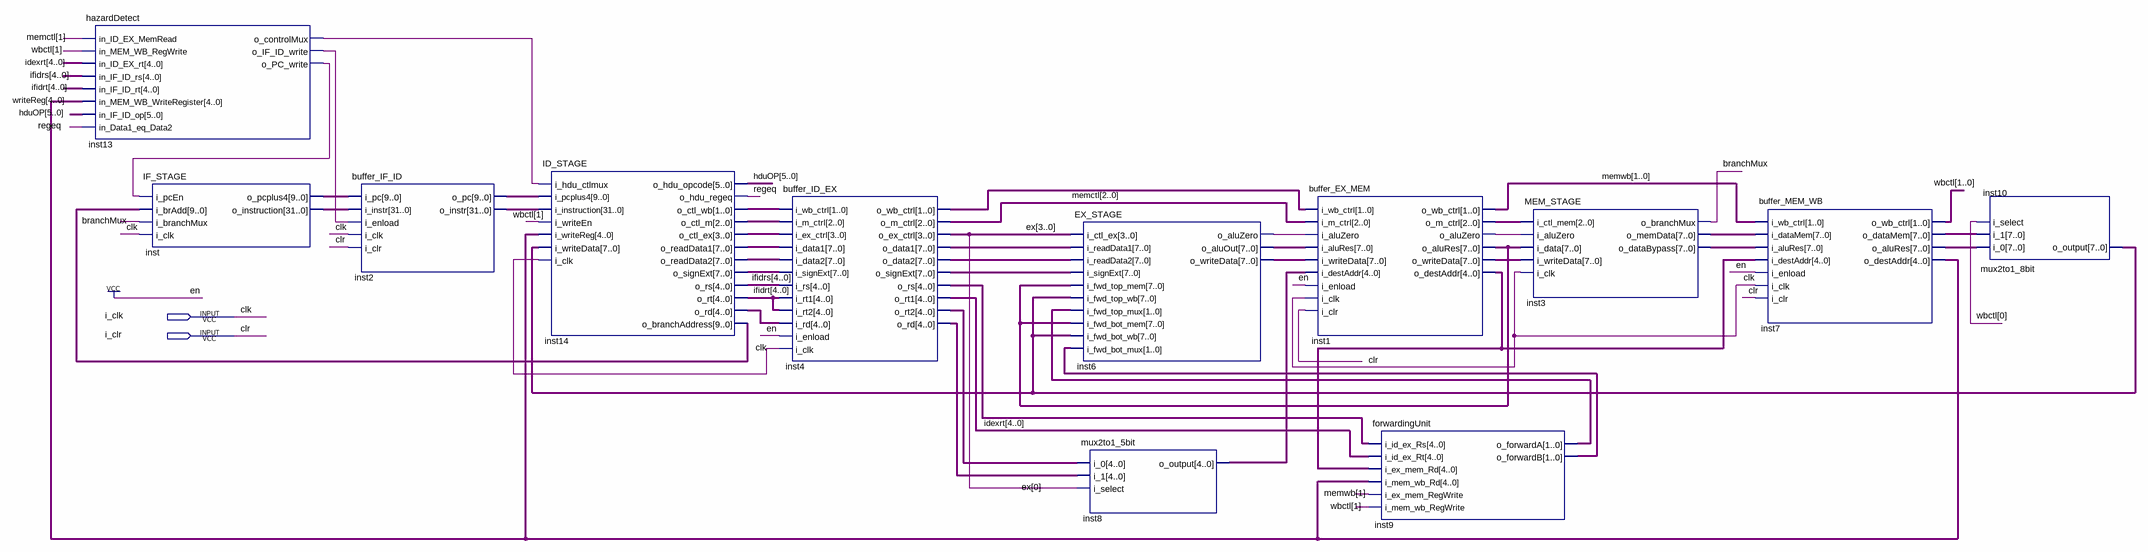
[diagram p0: schematic sheet]
// Quartus schematic lab3top.bdf as structural Verilog: 12 symbols, 2 pins
module lab3top (
  input  i_clk,
  input  i_clr
);

  wire branchMux, inst1_o_aluzero, inst6_o_aluzero, inst13_o_controlmux, inst13_o_if_id_write,
       inst13_o_pc_write, regeq;
  wire [1:0] inst4_o_wb_ctrl, inst9_o_forwarda, inst9_o_forwardb, inst14_o_ctl_wb, memwb, wbctl;
  wire [2:0] inst1_o_m_ctrl, inst14_o_ctl_m, memctl;
  wire [3:0] ex, inst14_o_ctl_ex;
  wire [4:0] idexrt, ifidrs, ifidrt, inst1_o_destaddr, inst4_o_rd, inst4_o_rs, inst4_o_rt2, inst8_o_output,
       inst14_o_rd, writeReg;
  wire [5:0] hduOP;
  wire [7:0] inst1_o_alures, inst1_o_writedata, inst3_o_databypass, inst3_o_memdata, inst4_o_data1,
       inst4_o_data2, inst4_o_signext, inst6_o_aluout, inst6_o_writedata, inst7_o_alures, inst7_o_datamem,
       inst10_o_output, inst14_o_readdata1, inst14_o_readdata2, inst14_o_signext;
  wire [9:0] inst2_o_pc, inst14_o_branchaddress, inst_o_pcplus4;
  wire [31:0] inst2_o_instr, inst_o_instruction;

  hazardDetect inst13 (
    .in_ID_EX_MemRead(memctl[1]), .in_MEM_WB_RegWrite(wbctl[1]), .in_ID_EX_rt(idexrt), .in_IF_ID_rs(ifidrs),
    .in_IF_ID_rt(ifidrt), .in_MEM_WB_WriteRegister(writeReg), .in_IF_ID_op(hduOP), .in_Data1_eq_Data2(regeq),
    .o_controlMux(inst13_o_controlmux), .o_IF_ID_write(inst13_o_if_id_write), .o_PC_write(inst13_o_pc_write));
  IF_STAGE inst (
    .i_pcEn(inst13_o_pc_write), .i_brAdd(inst14_o_branchaddress), .i_branchMux(branchMux), .i_clk(i_clk),
    .o_pcplus4(inst_o_pcplus4), .o_instruction(inst_o_instruction));
  buffer_IF_ID inst2 (
    .i_pc(inst_o_pcplus4), .i_instr(inst_o_instruction), .i_enload(inst13_o_if_id_write), .i_clk(i_clk),
    .i_clr(i_clr), .o_pc(inst2_o_pc), .o_instr(inst2_o_instr));
  ID_STAGE inst14 (
    .i_hdu_ctlmux(inst13_o_controlmux), .i_pcplus4(inst2_o_pc), .i_instruction(inst2_o_instr),
    .i_writeEn(wbctl[1]), .i_writeReg(writeReg), .i_writeData(inst10_o_output), .i_clk(i_clk),
    .o_hdu_opcode(hduOP), .o_hdu_regeq(regeq), .o_ctl_wb(inst14_o_ctl_wb), .o_ctl_m(inst14_o_ctl_m),
    .o_ctl_ex(inst14_o_ctl_ex), .o_readData1(inst14_o_readdata1), .o_readData2(inst14_o_readdata2),
    .o_signExt(inst14_o_signext), .o_rs(ifidrs), .o_rt(ifidrt), .o_rd(inst14_o_rd),
    .o_branchAddress(inst14_o_branchaddress));
  buffer_ID_EX inst4 (
    .i_wb_ctrl(inst14_o_ctl_wb), .i_m_ctrl(inst14_o_ctl_m), .i_ex_ctrl(inst14_o_ctl_ex),
    .i_data1(inst14_o_readdata1), .i_data2(inst14_o_readdata2), .i_signExt(inst14_o_signext), .i_rs(ifidrs),
    .i_rt1(ifidrt), .i_rt2(ifidrt), .i_rd(inst14_o_rd), .i_enload(1'b1), .i_clk(i_clk),
    .o_wb_ctrl(inst4_o_wb_ctrl), .o_m_ctrl(memctl), .o_ex_ctrl(ex), .o_data1(inst4_o_data1),
    .o_data2(inst4_o_data2), .o_signExt(inst4_o_signext), .o_rs(inst4_o_rs), .o_rt1(idexrt),
    .o_rt2(inst4_o_rt2), .o_rd(inst4_o_rd));
  EX_STAGE inst6 (
    .i_ctl_ex(ex), .i_readData1(inst4_o_data1), .i_readData2(inst4_o_data2), .i_signExt(inst4_o_signext),
    .i_fwd_top_mem(inst1_o_alures), .i_fwd_top_wb(inst10_o_output), .i_fwd_top_mux(inst9_o_forwarda),
    .i_fwd_bot_mem(inst1_o_alures), .i_fwd_bot_wb(inst10_o_output), .i_fwd_bot_mux(inst9_o_forwardb),
    .o_aluZero(inst6_o_aluzero), .o_aluOut(inst6_o_aluout), .o_writeData(inst6_o_writedata));
  mux2to1_5bit inst8 (.i_0(inst4_o_rt2), .i_1(inst4_o_rd), .i_select(ex[0]), .o_output(inst8_o_output));
  buffer_EX_MEM inst1 (
    .i_wb_ctrl(inst4_o_wb_ctrl), .i_m_ctrl(memctl), .i_aluZero(inst6_o_aluzero), .i_aluRes(inst6_o_aluout),
    .i_writeData(inst6_o_writedata), .i_destAddr(inst8_o_output), .i_enload(1'b1), .i_clk(i_clk),
    .i_clr(i_clr), .o_wb_ctrl(memwb), .o_m_ctrl(inst1_o_m_ctrl), .o_aluZero(inst1_o_aluzero),
    .o_aluRes(inst1_o_alures), .o_writeData(inst1_o_writedata), .o_destAddr(inst1_o_destaddr));
  forwardingUnit inst9 (
    .i_id_ex_Rs(inst4_o_rs), .i_id_ex_Rt(idexrt), .i_ex_mem_Rd(inst1_o_destaddr), .i_mem_wb_Rd(writeReg),
    .i_ex_mem_RegWrite(memwb[1]), .i_mem_wb_RegWrite(wbctl[1]), .o_forwardA(inst9_o_forwarda),
    .o_forwardB(inst9_o_forwardb));
  MEM_STAGE inst3 (
    .i_ctl_mem(inst1_o_m_ctrl), .i_aluZero(inst1_o_aluzero), .i_data(inst1_o_alures),
    .i_writeData(inst1_o_writedata), .i_clk(i_clk), .o_branchMux(branchMux), .o_memData(inst3_o_memdata),
    .o_dataBypass(inst3_o_databypass));
  buffer_MEM_WB inst7 (
    .i_wb_ctrl(memwb), .i_dataMem(inst3_o_memdata), .i_aluRes(inst3_o_databypass),
    .i_destAddr(inst1_o_destaddr), .i_enload(1'b1), .i_clk(i_clk), .i_clr(i_clr), .o_wb_ctrl(wbctl),
    .o_dataMem(inst7_o_datamem), .o_aluRes(inst7_o_alures), .o_destAddr(writeReg));
  mux2to1_8bit inst10 (.i_0(inst7_o_alures), .i_1(inst7_o_datamem), .i_select(wbctl[0]), .o_output(inst10_o_output));

  // Other names for the same wires on the sheet: clk = i_clk; clr = i_clr
endmodule
